# EAGLE schematic RASP_GPIO_DAC_ADC_1 (EAGLE 7.5.0)
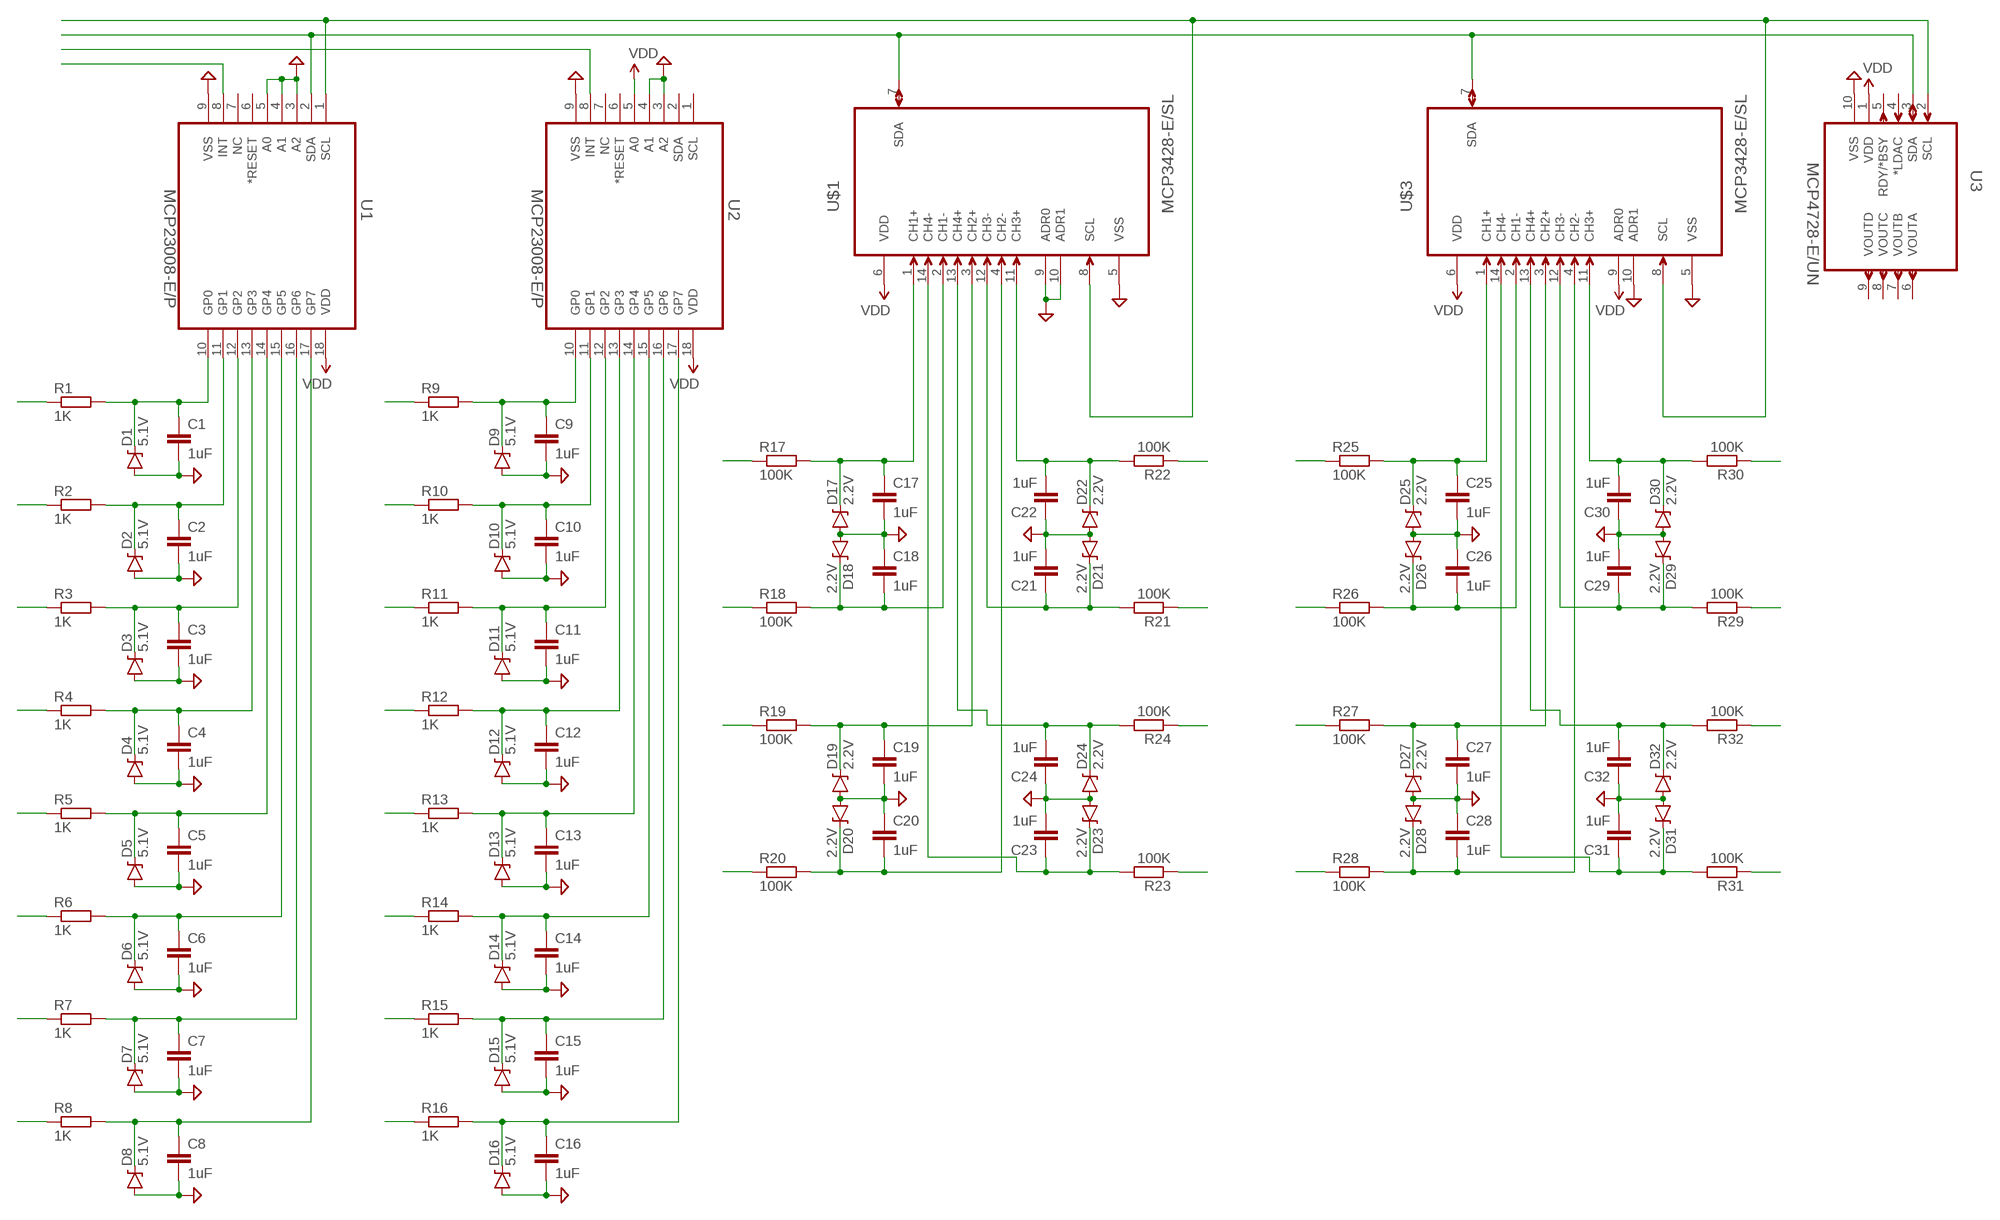
[diagram p0: schematic, sheet 1]

## Parts
C1  1uF  C2,5-3  [C2.5-3]
C2  1uF  C2,5-3  [C2.5-3]
C3  1uF  C2,5-3  [C2.5-3]
C4  1uF  C2,5-3  [C2.5-3]
C5  1uF  C2,5-3  [C2.5-3]
C6  1uF  C2,5-3  [C2.5-3]
C7  1uF  C2,5-3  [C2.5-3]
C8  1uF  C2,5-3  [C2.5-3]
C9  1uF  C2,5-3  [C2.5-3]
C10  1uF  C2,5-3  [C2.5-3]
C11  1uF  C2,5-3  [C2.5-3]
C12  1uF  C2,5-3  [C2.5-3]
C13  1uF  C2,5-3  [C2.5-3]
C14  1uF  C2,5-3  [C2.5-3]
C15  1uF  C2,5-3  [C2.5-3]
C16  1uF  C2,5-3  [C2.5-3]
C17  1uF  C2,5-3  [C2.5-3]
C18  1uF  C2,5-3  [C2.5-3]
C19  1uF  C2,5-3  [C2.5-3]
C20  1uF  C2,5-3  [C2.5-3]
C21  1uF  C2,5-3  [C2.5-3]
C22  1uF  C2,5-3  [C2.5-3]
C23  1uF  C2,5-3  [C2.5-3]
C24  1uF  C2,5-3  [C2.5-3]
C25  1uF  C2,5-3  [C2.5-3]
C26  1uF  C2,5-3  [C2.5-3]
C27  1uF  C2,5-3  [C2.5-3]
C28  1uF  C2,5-3  [C2.5-3]
C29  1uF  C2,5-3  [C2.5-3]
C30  1uF  C2,5-3  [C2.5-3]
C31  1uF  C2,5-3  [C2.5-3]
C32  1uF  C2,5-3  [C2.5-3]
D1  5.1V  DIODE-ZENER5.6V  [SOD-323]
D2  5.1V  DIODE-ZENER5.6V  [SOD-323]
D3  5.1V  DIODE-ZENER5.6V  [SOD-323]
D4  5.1V  DIODE-ZENER5.6V  [SOD-323]
D5  5.1V  DIODE-ZENER5.6V  [SOD-323]
D6  5.1V  DIODE-ZENER5.6V  [SOD-323]
D7  5.1V  DIODE-ZENER5.6V  [SOD-323]
D8  5.1V  DIODE-ZENER5.6V  [SOD-323]
D9  5.1V  DIODE-ZENER5.6V  [SOD-323]
D10  5.1V  DIODE-ZENER5.6V  [SOD-323]
D11  5.1V  DIODE-ZENER5.6V  [SOD-323]
D12  5.1V  DIODE-ZENER5.6V  [SOD-323]
D13  5.1V  DIODE-ZENER5.6V  [SOD-323]
D14  5.1V  DIODE-ZENER5.6V  [SOD-323]
D15  5.1V  DIODE-ZENER5.6V  [SOD-323]
D16  5.1V  DIODE-ZENER5.6V  [SOD-323]
D17  2.2V  DIODE-ZENER5.6V  [SOD-323]
D18  2.2V  DIODE-ZENER5.6V  [SOD-323]
D19  2.2V  DIODE-ZENER5.6V  [SOD-323]
D20  2.2V  DIODE-ZENER5.6V  [SOD-323]
D21  2.2V  DIODE-ZENER5.6V  [SOD-323]
D22  2.2V  DIODE-ZENER5.6V  [SOD-323]
D23  2.2V  DIODE-ZENER5.6V  [SOD-323]
D24  2.2V  DIODE-ZENER5.6V  [SOD-323]
D25  2.2V  DIODE-ZENER5.6V  [SOD-323]
D26  2.2V  DIODE-ZENER5.6V  [SOD-323]
D27  2.2V  DIODE-ZENER5.6V  [SOD-323]
D28  2.2V  DIODE-ZENER5.6V  [SOD-323]
D29  2.2V  DIODE-ZENER5.6V  [SOD-323]
D30  2.2V  DIODE-ZENER5.6V  [SOD-323]
D31  2.2V  DIODE-ZENER5.6V  [SOD-323]
D32  2.2V  DIODE-ZENER5.6V  [SOD-323]
R1  1K  R-EU_0204/2V  [0204V]
R2  1K  R-EU_0204/2V  [0204V]
R3  1K  R-EU_0204/2V  [0204V]
R4  1K  R-EU_0204/2V  [0204V]
R5  1K  R-EU_0204/2V  [0204V]
R6  1K  R-EU_0204/2V  [0204V]
R7  1K  R-EU_0204/2V  [0204V]
R8  1K  R-EU_0204/2V  [0204V]
R9  1K  R-EU_0204/2V  [0204V]
R10  1K  R-EU_0204/2V  [0204V]
R11  1K  R-EU_0204/2V  [0204V]
R12  1K  R-EU_0204/2V  [0204V]
R13  1K  R-EU_0204/2V  [0204V]
R14  1K  R-EU_0204/2V  [0204V]
R15  1K  R-EU_0204/2V  [0204V]
R16  1K  R-EU_0204/2V  [0204V]
R17  100K  R-EU_0204/2V  [0204V]
R18  100K  R-EU_0204/2V  [0204V]
R19  100K  R-EU_0204/2V  [0204V]
R20  100K  R-EU_0204/2V  [0204V]
R21  100K  R-EU_0204/2V  [0204V]
R22  100K  R-EU_0204/2V  [0204V]
R23  100K  R-EU_0204/2V  [0204V]
R24  100K  R-EU_0204/2V  [0204V]
R25  100K  R-EU_0204/2V  [0204V]
R26  100K  R-EU_0204/2V  [0204V]
R27  100K  R-EU_0204/2V  [0204V]
R28  100K  R-EU_0204/2V  [0204V]
R29  100K  R-EU_0204/2V  [0204V]
R30  100K  R-EU_0204/2V  [0204V]
R31  100K  R-EU_0204/2V  [0204V]
R32  100K  R-EU_0204/2V  [0204V]
U1  MCP23008-E/P  [DIP254P762X533-18]
U2  MCP23008-E/P  [DIP254P762X533-18]
U3  MCP4728-E/UN  [SOP50P490X110-10N]
U$1  MCP3428-E/SL  [SOIC127P600X175-14N]
U$3  MCP3428-E/SL  [SOIC127P600X175-14N]

## Nets
GND: C1.2 C2.2 C3.2 C4.2 C5.2 C6.2 C7.2 C8.2 C9.2 C10.2 C11.2 C12.2 C13.2 C14.2 C15.2 C16.2 C17.2 C18.1 C19.2 C20.1 C21.2 C22.1 C23.2 C24.1 C25.2 C26.1 C27.2 C28.1 C29.2 C30.1 C31.2 C32.1 D1.A D2.A D3.A D4.A D5.A D6.A D7.A D8.A D9.A D10.A D11.A D12.A D13.A D14.A D15.A D16.A D17.A D18.A D19.A D20.A D21.A D22.A D23.A D24.A D25.A D26.A D27.A D28.A D29.A D30.A D31.A D32.A U1.3(A2) U1.4(A1) U1.5(A0) U1.9(VSS) U2.3(A2) U2.4(A1) U2.9(VSS) U3.10(VSS) U$1.5(VSS) U$1.9(ADR0) U$1.10(ADR1) U$3.5(VSS) U$3.10(ADR1)
N$1: U1.1(SCL) U3.2(SCL) U$1.8(SCL) U$3.8(SCL)
N$2: U1.8(INT)
N$3: U1.2(SDA) U3.3(SDA) U$1.7(SDA) U$3.7(SDA)
N$4: U2.8(INT)
N$5: C1.1 D1.C R1.2 U1.10(GP0)
N$6: C2.1 D2.C R2.2 U1.11(GP1)
N$7: R1.1
N$8: R2.1
N$9: C3.1 D3.C R3.2 U1.12(GP2)
N$10: R3.1
N$11: C4.1 D4.C R4.2 U1.13(GP3)
N$12: R4.1
N$13: C5.1 D5.C R5.2 U1.14(GP4)
N$14: R5.1
N$15: C6.1 D6.C R6.2 U1.15(GP5)
N$16: R6.1
N$17: C7.1 D7.C R7.2 U1.16(GP6)
N$18: R7.1
N$19: C8.1 D8.C R8.2 U1.17(GP7)
N$20: R8.1
N$21: C9.1 D9.C R9.2
N$22: R9.1
N$23: C10.1 D10.C R10.2
N$24: R10.1
N$25: C11.1 D11.C R11.2
N$26: R11.1
N$27: C12.1 D12.C R12.2
N$28: R12.1
N$29: C13.1 D13.C R13.2
N$30: R13.1
N$31: C14.1 D14.C R14.2
N$32: R14.1
N$33: C15.1 D15.C R15.2
N$34: R15.1
N$35: C16.1 D16.C R16.2
N$36: R16.1
N$37: C17.1 D17.C R17.2 U$1.1(CH1+)
N$38: R17.1
N$39: C18.2 D18.C R18.2 U$1.2(CH1-)
N$40: C21.1 D21.C R21.2 U$1.12(CH3-)
N$41: R18.1
N$42: C19.1 D19.C R19.2 U$1.3(CH2+)
N$43: R19.1
N$44: C20.2 D20.C R20.2 U$1.4(CH2-)
N$45: R20.1
N$46: R21.1
N$47: C22.2 D22.C R22.2 U$1.11(CH3+)
N$48: R22.1
N$49: C23.1 D23.C R23.2 U$1.14(CH4-)
N$50: R23.1
N$51: C24.2 D24.C R24.2 U$1.13(CH4+)
N$52: R24.1
N$53: C25.1 D25.C R25.2
N$54: R25.1
N$55: C26.2 D26.C R26.2
N$56: R26.1
N$57: C27.1 D27.C R27.2
N$58: R27.1
N$59: C28.2 D28.C R28.2
N$60: R28.1
N$61: C29.1 D29.C R29.2
N$62: R29.1
N$63: C30.2 D30.C R30.2
N$64: R30.1
N$65: C31.1 D31.C R31.2
N$66: R31.1
N$67: C32.2 D32.C R32.2
N$68: R32.1
VDD: U1.18(VDD) U2.5(A0) U2.18(VDD) U3.1(VDD) U$1.6(VDD) U$3.6(VDD) U$3.9(ADR0)
Unconnected: U1.6(*RESET) U1.7(NC) U2.1(SCL) U2.2(SDA) U2.6(*RESET) U2.7(NC) U2.10(GP0) U2.11(GP1) U2.12(GP2) U2.13(GP3) U2.14(GP4) U2.15(GP5) U2.16(GP6) U2.17(GP7) U3.4(*LDAC) U3.5(RDY/*BSY) U3.6(VOUTA) U3.7(VOUTB) U3.8(VOUTC) U3.9(VOUTD) U$3.1(CH1+) U$3.2(CH1-) U$3.3(CH2+) U$3.4(CH2-) U$3.11(CH3+) U$3.12(CH3-) U$3.13(CH4+) U$3.14(CH4-)

## Library data of the parts
C1-C32 = capacitor-wima:C: CAPACITOR naming: grid - package width
D1-D32 = SparkFun-DiscreteSemi:DIODE-ZENER: Zener Diode Production Part - 8199 3.4V Zener Voltage; PROD_ID: DIO-12442; VALUE: 5.6V
R1-R32 = resistor:R-EU_: RESISTOR, European symbol
U1 U2 = Microchip_By_element14_Batch_1:MCP23008-E/P: IC I/O EXPANDER I2C 8B; MPN: MCP23008-E/P; OC_FARNELL: 1439387; OC_NEWARK: 08J8737; PACKAGE: 18DIP; SUPPLIER: Microchip
U3 = Microchip_By_element14_Batch_1:MCP4728-E/UN: IC, DAC, 12BIT, QUAD; MPN: MCP4728-E/UN; OC_FARNELL: 1800217; OC_NEWARK: 08R1808; PACKAGE: MSOP-10; SUPPLIER: MICROCHIP
U$1 U$3 = Microchip_By_element14_Batch_1:MCP3428-E/SL: Analog-to-Digital Converter; MPN: MCP3428-E/SL; OC_FARNELL: 1825014; OC_NEWARK: 52R9962; PACKAGE: SOIC-14; SUPPLIER: Microchip